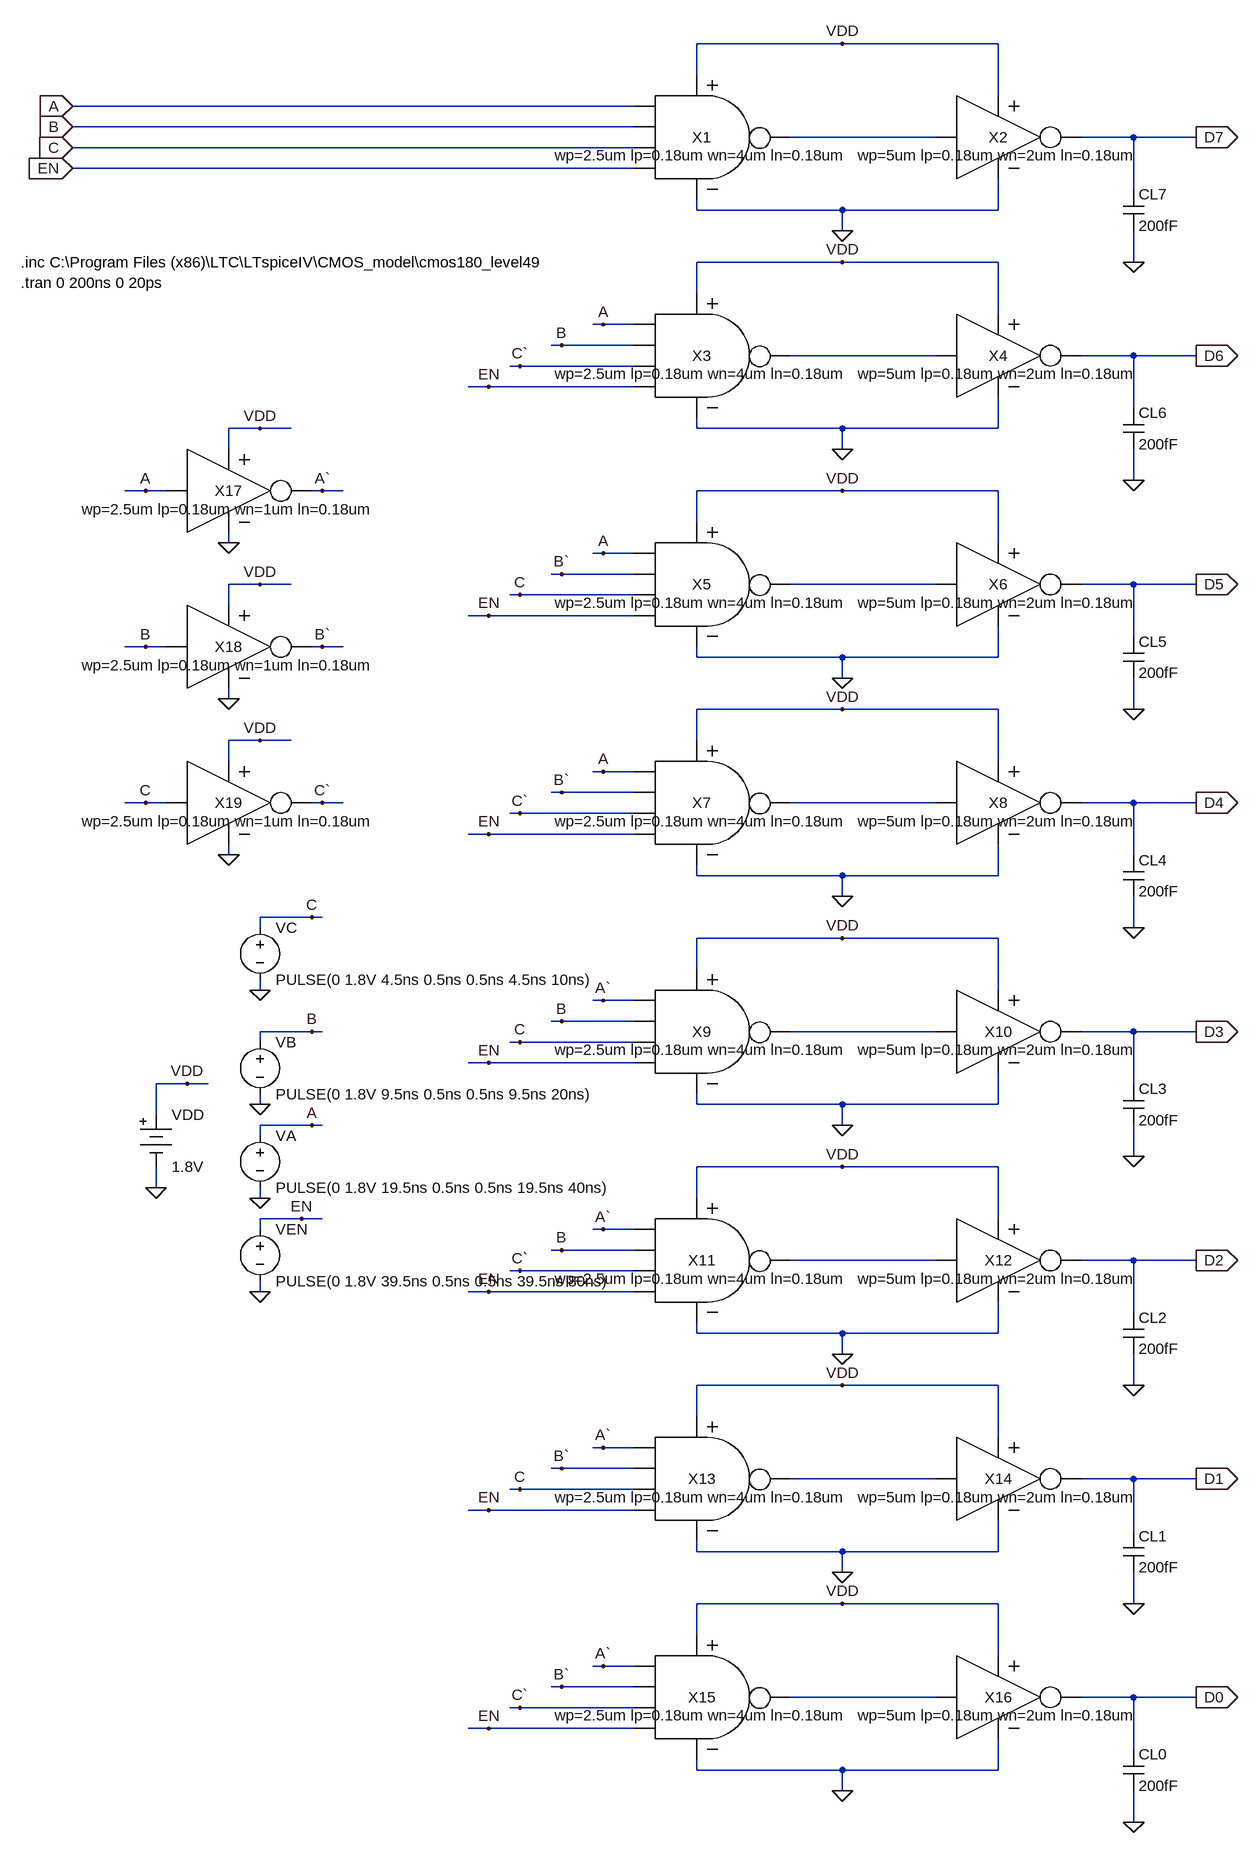
[diagram p0: schematic lab1-1.asc]
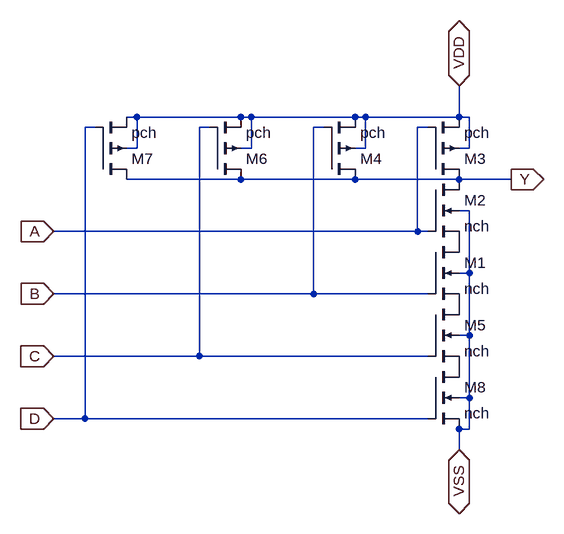
[diagram p1: sub-circuit nand4.asc]
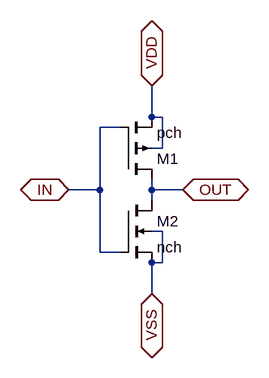
[diagram p2: sub-circuit inv.asc]
lab1-1.asc, the LTspice schematic file:
Version 4
SHEET 1 880 680
WIRE -2896 -4208 -3120 -4208
WIRE -2656 -4208 -2896 -4208
WIRE -3120 -4160 -3120 -4208
WIRE -2656 -4128 -2656 -4208
WIRE -3216 -4112 -4080 -4112
WIRE -3216 -4080 -4080 -4080
WIRE -2752 -4064 -2976 -4064
WIRE -2448 -4064 -2528 -4064
WIRE -2352 -4064 -2448 -4064
WIRE -3216 -4048 -4080 -4048
WIRE -3216 -4016 -4080 -4016
WIRE -2448 -3984 -2448 -4064
WIRE -3120 -3952 -3120 -3968
WIRE -2896 -3952 -3120 -3952
WIRE -2656 -3952 -2656 -4000
WIRE -2656 -3952 -2896 -3952
WIRE -2896 -3920 -2896 -3952
WIRE -2896 -3872 -3120 -3872
WIRE -2656 -3872 -2896 -3872
WIRE -2448 -3872 -2448 -3920
WIRE -3120 -3824 -3120 -3872
WIRE -2656 -3792 -2656 -3872
WIRE -3264 -3776 -3280 -3776
WIRE -3216 -3776 -3264 -3776
WIRE -3328 -3744 -3344 -3744
WIRE -3216 -3744 -3328 -3744
WIRE -2752 -3728 -2976 -3728
WIRE -2448 -3728 -2528 -3728
WIRE -2352 -3728 -2448 -3728
WIRE -3392 -3712 -3408 -3712
WIRE -3216 -3712 -3392 -3712
WIRE -3440 -3680 -3472 -3680
WIRE -3216 -3680 -3440 -3680
WIRE -2448 -3648 -2448 -3728
WIRE -3792 -3616 -3840 -3616
WIRE -3744 -3616 -3792 -3616
WIRE -3120 -3616 -3120 -3632
WIRE -2896 -3616 -3120 -3616
WIRE -2656 -3616 -2656 -3664
WIRE -2656 -3616 -2896 -3616
WIRE -3840 -3584 -3840 -3616
WIRE -2896 -3584 -2896 -3616
WIRE -2448 -3536 -2448 -3584
WIRE -3968 -3520 -4000 -3520
WIRE -3936 -3520 -3968 -3520
WIRE -3696 -3520 -3712 -3520
WIRE -3664 -3520 -3696 -3520
WIRE -2896 -3520 -3120 -3520
WIRE -2656 -3520 -2896 -3520
WIRE -3120 -3472 -3120 -3520
WIRE -3840 -3440 -3840 -3456
WIRE -2656 -3440 -2656 -3520
WIRE -3264 -3424 -3280 -3424
WIRE -3216 -3424 -3264 -3424
WIRE -3328 -3392 -3344 -3392
WIRE -3216 -3392 -3328 -3392
WIRE -3792 -3376 -3840 -3376
WIRE -3744 -3376 -3792 -3376
WIRE -2752 -3376 -2976 -3376
WIRE -2448 -3376 -2528 -3376
WIRE -2352 -3376 -2448 -3376
WIRE -3392 -3360 -3408 -3360
WIRE -3216 -3360 -3392 -3360
WIRE -3840 -3344 -3840 -3376
WIRE -3440 -3328 -3472 -3328
WIRE -3216 -3328 -3440 -3328
WIRE -2448 -3296 -2448 -3376
WIRE -3968 -3280 -4000 -3280
WIRE -3936 -3280 -3968 -3280
WIRE -3696 -3280 -3712 -3280
WIRE -3664 -3280 -3696 -3280
WIRE -3120 -3264 -3120 -3280
WIRE -2896 -3264 -3120 -3264
WIRE -2656 -3264 -2656 -3312
WIRE -2656 -3264 -2896 -3264
WIRE -2896 -3232 -2896 -3264
WIRE -3840 -3200 -3840 -3216
WIRE -2896 -3184 -3120 -3184
WIRE -2656 -3184 -2896 -3184
WIRE -2448 -3184 -2448 -3232
WIRE -3792 -3136 -3840 -3136
WIRE -3744 -3136 -3792 -3136
WIRE -3120 -3136 -3120 -3184
WIRE -3840 -3104 -3840 -3136
WIRE -2656 -3104 -2656 -3184
WIRE -3264 -3088 -3280 -3088
WIRE -3216 -3088 -3264 -3088
WIRE -3328 -3056 -3344 -3056
WIRE -3216 -3056 -3328 -3056
WIRE -3968 -3040 -4000 -3040
WIRE -3936 -3040 -3968 -3040
WIRE -3696 -3040 -3712 -3040
WIRE -3664 -3040 -3696 -3040
WIRE -2752 -3040 -2976 -3040
WIRE -2448 -3040 -2528 -3040
WIRE -2352 -3040 -2448 -3040
WIRE -3392 -3024 -3408 -3024
WIRE -3216 -3024 -3392 -3024
WIRE -3440 -2992 -3472 -2992
WIRE -3216 -2992 -3440 -2992
WIRE -3840 -2960 -3840 -2976
WIRE -2448 -2960 -2448 -3040
WIRE -3120 -2928 -3120 -2944
WIRE -2896 -2928 -3120 -2928
WIRE -2656 -2928 -2656 -2976
WIRE -2656 -2928 -2896 -2928
WIRE -2896 -2896 -2896 -2928
WIRE -3712 -2864 -3792 -2864
WIRE -3696 -2864 -3712 -2864
WIRE -3792 -2848 -3792 -2864
WIRE -2448 -2848 -2448 -2896
WIRE -2896 -2832 -3120 -2832
WIRE -2656 -2832 -2896 -2832
WIRE -3120 -2784 -3120 -2832
WIRE -3792 -2752 -3792 -2768
WIRE -2656 -2752 -2656 -2832
WIRE -3264 -2736 -3280 -2736
WIRE -3216 -2736 -3264 -2736
WIRE -3328 -2704 -3344 -2704
WIRE -3216 -2704 -3328 -2704
WIRE -3712 -2688 -3792 -2688
WIRE -3696 -2688 -3712 -2688
WIRE -2752 -2688 -2976 -2688
WIRE -2448 -2688 -2528 -2688
WIRE -2352 -2688 -2448 -2688
WIRE -3792 -2672 -3792 -2688
WIRE -3392 -2672 -3408 -2672
WIRE -3216 -2672 -3392 -2672
WIRE -3440 -2640 -3472 -2640
WIRE -3216 -2640 -3440 -2640
WIRE -3904 -2608 -3952 -2608
WIRE -3872 -2608 -3904 -2608
WIRE -2448 -2608 -2448 -2688
WIRE -3792 -2576 -3792 -2592
WIRE -3120 -2576 -3120 -2592
WIRE -2896 -2576 -3120 -2576
WIRE -2656 -2576 -2656 -2624
WIRE -2656 -2576 -2896 -2576
WIRE -3952 -2560 -3952 -2608
WIRE -3712 -2544 -3792 -2544
WIRE -3696 -2544 -3712 -2544
WIRE -2896 -2544 -2896 -2576
WIRE -3792 -2528 -3792 -2544
WIRE -2448 -2496 -2448 -2544
WIRE -2896 -2480 -3120 -2480
WIRE -2656 -2480 -2896 -2480
WIRE -3952 -2448 -3952 -2480
WIRE -3792 -2432 -3792 -2448
WIRE -3120 -2432 -3120 -2480
WIRE -3728 -2400 -3792 -2400
WIRE -3696 -2400 -3728 -2400
WIRE -2656 -2400 -2656 -2480
WIRE -3792 -2384 -3792 -2400
WIRE -3264 -2384 -3280 -2384
WIRE -3216 -2384 -3264 -2384
WIRE -3328 -2352 -3344 -2352
WIRE -3216 -2352 -3328 -2352
WIRE -2752 -2336 -2976 -2336
WIRE -2448 -2336 -2528 -2336
WIRE -2352 -2336 -2448 -2336
WIRE -3392 -2320 -3408 -2320
WIRE -3216 -2320 -3392 -2320
WIRE -3792 -2288 -3792 -2304
WIRE -3440 -2288 -3472 -2288
WIRE -3216 -2288 -3440 -2288
WIRE -2448 -2256 -2448 -2336
WIRE -3120 -2224 -3120 -2240
WIRE -2896 -2224 -3120 -2224
WIRE -2656 -2224 -2656 -2272
WIRE -2656 -2224 -2896 -2224
WIRE -2896 -2192 -2896 -2224
WIRE -2896 -2144 -3120 -2144
WIRE -2656 -2144 -2896 -2144
WIRE -2448 -2144 -2448 -2192
WIRE -3120 -2096 -3120 -2144
WIRE -2656 -2064 -2656 -2144
WIRE -3264 -2048 -3280 -2048
WIRE -3216 -2048 -3264 -2048
WIRE -3328 -2016 -3344 -2016
WIRE -3216 -2016 -3328 -2016
WIRE -2752 -2000 -2976 -2000
WIRE -2448 -2000 -2528 -2000
WIRE -2352 -2000 -2448 -2000
WIRE -3392 -1984 -3408 -1984
WIRE -3216 -1984 -3392 -1984
WIRE -3440 -1952 -3472 -1952
WIRE -3216 -1952 -3440 -1952
WIRE -2448 -1920 -2448 -2000
WIRE -3120 -1888 -3120 -1904
WIRE -2896 -1888 -3120 -1888
WIRE -2656 -1888 -2656 -1936
WIRE -2656 -1888 -2896 -1888
WIRE -2896 -1856 -2896 -1888
WIRE -2896 -1808 -3120 -1808
WIRE -2656 -1808 -2896 -1808
WIRE -2448 -1808 -2448 -1856
WIRE -3120 -1760 -3120 -1808
WIRE -2656 -1728 -2656 -1808
WIRE -3264 -1712 -3280 -1712
WIRE -3216 -1712 -3264 -1712
WIRE -3328 -1680 -3344 -1680
WIRE -3216 -1680 -3328 -1680
WIRE -2752 -1664 -2976 -1664
WIRE -2448 -1664 -2528 -1664
WIRE -2352 -1664 -2448 -1664
WIRE -3392 -1648 -3408 -1648
WIRE -3216 -1648 -3392 -1648
WIRE -3440 -1616 -3472 -1616
WIRE -3216 -1616 -3440 -1616
WIRE -2448 -1584 -2448 -1664
WIRE -3120 -1552 -3120 -1568
WIRE -2896 -1552 -3120 -1552
WIRE -2656 -1552 -2656 -1600
WIRE -2656 -1552 -2896 -1552
WIRE -2896 -1520 -2896 -1552
WIRE -2448 -1472 -2448 -1520
FLAG -3792 -2576 0
FLAG -3792 -2432 0
FLAG -3792 -2288 0
FLAG -3792 -2752 0
FLAG -3952 -2448 0
FLAG -3904 -2608 VDD
FLAG -3728 -2400 EN
FLAG -3712 -2864 C
FLAG -3712 -2688 B
FLAG -3712 -2544 A
FLAG -2896 -3920 0
FLAG -2448 -3872 0
FLAG -2352 -4064 D7
IOPIN -2352 -4064 Out
FLAG -2896 -3584 0
FLAG -2448 -3536 0
FLAG -2352 -3728 D6
IOPIN -2352 -3728 Out
FLAG -3440 -3680 EN
FLAG -3392 -3712 C`
FLAG -3328 -3744 B
FLAG -3264 -3776 A
FLAG -2896 -3232 0
FLAG -2448 -3184 0
FLAG -2352 -3376 D5
IOPIN -2352 -3376 Out
FLAG -3440 -3328 EN
FLAG -3392 -3360 C
FLAG -3328 -3392 B`
FLAG -3264 -3424 A
FLAG -2896 -2896 0
FLAG -2448 -2848 0
FLAG -2352 -3040 D4
IOPIN -2352 -3040 Out
FLAG -3440 -2992 EN
FLAG -3392 -3024 C`
FLAG -3328 -3056 B`
FLAG -3264 -3088 A
FLAG -2896 -2544 0
FLAG -2448 -2496 0
FLAG -2352 -2688 D3
IOPIN -2352 -2688 Out
FLAG -3440 -2640 EN
FLAG -3392 -2672 C
FLAG -3328 -2704 B
FLAG -3264 -2736 A`
FLAG -2896 -2192 0
FLAG -2448 -2144 0
FLAG -2352 -2336 D2
IOPIN -2352 -2336 Out
FLAG -3440 -2288 EN
FLAG -3392 -2320 C`
FLAG -3328 -2352 B
FLAG -3264 -2384 A`
FLAG -2896 -1856 0
FLAG -2448 -1808 0
FLAG -2352 -2000 D1
IOPIN -2352 -2000 Out
FLAG -3440 -1952 EN
FLAG -3392 -1984 C
FLAG -3328 -2016 B`
FLAG -3264 -2048 A`
FLAG -2896 -1520 0
FLAG -2448 -1472 0
FLAG -2352 -1664 D0
IOPIN -2352 -1664 Out
FLAG -3440 -1616 EN
FLAG -3392 -1648 C`
FLAG -3328 -1680 B`
FLAG -3264 -1712 A`
FLAG -3840 -3440 0
FLAG -3792 -3616 VDD
FLAG -4080 -4112 A
IOPIN -4080 -4112 In
FLAG -4080 -4080 B
IOPIN -4080 -4080 In
FLAG -4080 -4048 C
IOPIN -4080 -4048 In
FLAG -4080 -4016 EN
IOPIN -4080 -4016 In
FLAG -3840 -3200 0
FLAG -3792 -3376 VDD
FLAG -3840 -2960 0
FLAG -3792 -3136 VDD
FLAG -3968 -3280 B
FLAG -3968 -3040 C
FLAG -3968 -3520 A
FLAG -3696 -3520 A`
FLAG -3696 -3280 B`
FLAG -3696 -3040 C`
FLAG -2896 -2832 VDD
FLAG -2896 -3184 VDD
FLAG -2896 -3520 VDD
FLAG -2896 -3872 VDD
FLAG -2896 -2144 VDD
FLAG -2896 -1808 VDD
FLAG -2896 -2480 VDD
FLAG -2896 -4208 VDD
SYMBOL Misc\\battery -3952 -2576 R0
WINDOW 123 0 0 Left 2
WINDOW 39 0 0 Left 2
SYMATTR InstName VDD
SYMATTR Value 1.8V
SYMBOL voltage -3792 -2864 R0
WINDOW 123 0 0 Left 2
WINDOW 39 0 0 Left 2
SYMATTR InstName VC
SYMATTR Value PULSE(0 1.8V 4.5ns 0.5ns 0.5ns 4.5ns 10ns)
SYMBOL voltage -3792 -2688 R0
SYMATTR InstName VB
SYMATTR Value PULSE(0 1.8V 9.5ns 0.5ns 0.5ns 9.5ns 20ns)
SYMBOL voltage -3792 -2544 R0
WINDOW 123 0 0 Left 2
WINDOW 39 0 0 Left 2
SYMATTR InstName VA
SYMATTR Value PULSE(0 1.8V 19.5ns 0.5ns 0.5ns 19.5ns 40ns)
SYMBOL voltage -3792 -2400 R0
WINDOW 123 0 0 Left 2
WINDOW 39 0 0 Left 2
SYMATTR InstName VEN
SYMATTR Value PULSE(0 1.8V 39.5ns 0.5ns 0.5ns 39.5ns 80ns)
SYMBOL nand4 -3104 -4064 R0
WINDOW 39 -8 28 Center 2
SYMATTR SpiceLine wp=2.5um lp=0.18um wn=4um ln=0.18um
SYMATTR InstName X1
SYMBOL inv -2656 -4064 R0
WINDOW 39 0 28 Center 2
SYMATTR SpiceLine wp=5um lp=0.18um wn=2um ln=0.18um
SYMATTR InstName X2
SYMBOL cap -2464 -3984 R0
SYMATTR InstName CL7
SYMATTR Value 200fF
SYMBOL nand4 -3104 -3728 R0
WINDOW 39 -8 28 Center 2
SYMATTR SpiceLine wp=2.5um lp=0.18um wn=4um ln=0.18um
SYMATTR InstName X3
SYMBOL inv -2656 -3728 R0
WINDOW 39 0 28 Center 2
SYMATTR SpiceLine wp=5um lp=0.18um wn=2um ln=0.18um
SYMATTR InstName X4
SYMBOL cap -2464 -3648 R0
SYMATTR InstName CL6
SYMATTR Value 200fF
SYMBOL nand4 -3104 -3376 R0
WINDOW 39 -8 28 Center 2
SYMATTR SpiceLine wp=2.5um lp=0.18um wn=4um ln=0.18um
SYMATTR InstName X5
SYMBOL inv -2656 -3376 R0
WINDOW 39 0 28 Center 2
SYMATTR SpiceLine wp=5um lp=0.18um wn=2um ln=0.18um
SYMATTR InstName X6
SYMBOL cap -2464 -3296 R0
SYMATTR InstName CL5
SYMATTR Value 200fF
SYMBOL nand4 -3104 -3040 R0
WINDOW 39 -8 28 Center 2
SYMATTR SpiceLine wp=2.5um lp=0.18um wn=4um ln=0.18um
SYMATTR InstName X7
SYMBOL inv -2656 -3040 R0
WINDOW 39 0 28 Center 2
SYMATTR SpiceLine wp=5um lp=0.18um wn=2um ln=0.18um
SYMATTR InstName X8
SYMBOL cap -2464 -2960 R0
SYMATTR InstName CL4
SYMATTR Value 200fF
SYMBOL nand4 -3104 -2688 R0
WINDOW 39 -8 28 Center 2
SYMATTR SpiceLine wp=2.5um lp=0.18um wn=4um ln=0.18um
SYMATTR InstName X9
SYMBOL inv -2656 -2688 R0
WINDOW 39 0 28 Center 2
SYMATTR SpiceLine wp=5um lp=0.18um wn=2um ln=0.18um
SYMATTR InstName X10
SYMBOL cap -2464 -2608 R0
SYMATTR InstName CL3
SYMATTR Value 200fF
SYMBOL nand4 -3104 -2336 R0
WINDOW 39 -8 28 Center 2
SYMATTR SpiceLine wp=2.5um lp=0.18um wn=4um ln=0.18um
SYMATTR InstName X11
SYMBOL inv -2656 -2336 R0
WINDOW 39 0 28 Center 2
SYMATTR SpiceLine wp=5um lp=0.18um wn=2um ln=0.18um
SYMATTR InstName X12
SYMBOL cap -2464 -2256 R0
SYMATTR InstName CL2
SYMATTR Value 200fF
SYMBOL nand4 -3104 -2000 R0
WINDOW 39 -8 28 Center 2
SYMATTR SpiceLine wp=2.5um lp=0.18um wn=4um ln=0.18um
SYMATTR InstName X13
SYMBOL inv -2656 -2000 R0
WINDOW 39 0 28 Center 2
SYMATTR SpiceLine wp=5um lp=0.18um wn=2um ln=0.18um
SYMATTR InstName X14
SYMBOL cap -2464 -1920 R0
SYMATTR InstName CL1
SYMATTR Value 200fF
SYMBOL nand4 -3104 -1664 R0
WINDOW 39 -8 28 Center 2
SYMATTR SpiceLine wp=2.5um lp=0.18um wn=4um ln=0.18um
SYMATTR InstName X15
SYMBOL inv -2656 -1664 R0
WINDOW 39 0 28 Center 2
SYMATTR SpiceLine wp=5um lp=0.18um wn=2um ln=0.18um
SYMATTR InstName X16
SYMBOL cap -2464 -1584 R0
SYMATTR InstName CL0
SYMATTR Value 200fF
SYMBOL inv -3840 -3520 R0
WINDOW 39 0 28 Center 2
SYMATTR SpiceLine wp=2.5um lp=0.18um wn=1um ln=0.18um
SYMATTR InstName X17
SYMBOL inv -3840 -3280 R0
WINDOW 39 0 28 Center 2
SYMATTR SpiceLine wp=2.5um lp=0.18um wn=1um ln=0.18um
SYMATTR InstName X18
SYMBOL inv -3840 -3040 R0
WINDOW 39 0 28 Center 2
SYMATTR SpiceLine wp=2.5um lp=0.18um wn=1um ln=0.18um
SYMATTR InstName X19
TEXT -4160 -3872 Left 2 !.inc C:\\Program Files (x86)\\LTC\\LTspiceIV\\CMOS_model\\cmos180_level49
TEXT -4160 -3840 Left 2 !.tran 0 200ns 0 20ps

nand4.asc, the sub-circuit schematic file:
Version 4
SHEET 1 880 680
WIRE -256 -32 -272 -32
WIRE -96 -32 -256 -32
WIRE -80 -32 -96 -32
WIRE 80 -32 -80 -32
WIRE 96 -32 80 -32
WIRE 240 -32 240 -80
WIRE 240 -32 96 -32
WIRE 256 -32 240 -32
WIRE -320 -16 -336 -16
WIRE -144 -16 -160 -16
WIRE 32 -16 16 -16
WIRE 192 -16 176 -16
WIRE -256 16 -256 -32
WIRE -256 16 -272 16
WIRE -80 16 -80 -32
WIRE -80 16 -96 16
WIRE 96 16 96 -32
WIRE 96 16 80 16
WIRE 256 16 256 -32
WIRE 256 16 240 16
WIRE -96 64 -272 64
WIRE 80 64 -96 64
WIRE 240 64 80 64
WIRE 320 64 240 64
WIRE 256 112 240 112
WIRE 176 144 176 -16
WIRE 176 144 -384 144
WIRE 192 144 176 144
WIRE 256 208 256 112
WIRE 256 208 240 208
WIRE 16 240 16 -16
WIRE 16 240 -384 240
WIRE 192 240 16 240
WIRE 256 304 256 208
WIRE 256 304 240 304
WIRE -160 336 -160 -16
WIRE -160 336 -384 336
WIRE 192 336 -160 336
WIRE 256 400 256 304
WIRE 256 400 240 400
WIRE -336 432 -336 -16
WIRE -336 432 -384 432
WIRE 192 432 -336 432
WIRE 256 448 256 400
WIRE 256 448 240 448
WIRE 240 480 240 448
FLAG -384 144 A
IOPIN -384 144 In
FLAG -384 240 B
IOPIN -384 240 In
FLAG 320 64 Y
IOPIN 320 64 Out
FLAG -384 336 C
IOPIN -384 336 In
FLAG -384 432 D
IOPIN -384 432 In
FLAG 240 480 VSS
IOPIN 240 480 BiDir
FLAG 240 -80 VDD
IOPIN 240 -80 BiDir
SYMBOL nmos4 192 160 R0
SYMATTR InstName M1
SYMATTR Value nch
SYMATTR Value2 l=ln w=wn
SYMBOL nmos4 192 64 R0
SYMATTR InstName M2
SYMATTR Value nch
SYMATTR Value2 l=ln w=wn
SYMBOL pmos4 192 64 M180
SYMATTR InstName M3
SYMATTR Value pch
SYMATTR Value2 l=lp w=wp
SYMBOL pmos4 32 64 M180
SYMATTR InstName M4
SYMATTR Value pch
SYMATTR Value2 l=lp w=wp
SYMBOL nmos4 192 256 R0
SYMATTR InstName M5
SYMATTR Value nch
SYMATTR Value2 l=ln w=wn
SYMBOL pmos4 -144 64 M180
SYMATTR InstName M6
SYMATTR Value pch
SYMATTR Value2 l=lp w=wp
SYMBOL nmos4 192 352 R0
SYMATTR InstName M8
SYMATTR Value nch
SYMATTR Value2 l=ln w=wn
SYMBOL pmos4 -320 64 M180
SYMATTR InstName M7
SYMATTR Value pch
SYMATTR Value2 l=lp w=wp

inv.asc, the sub-circuit schematic file:
Version 4
SHEET 1 880 680
WIRE 240 32 240 -16
WIRE 256 32 240 32
WIRE 192 48 160 48
WIRE 256 80 256 32
WIRE 256 80 240 80
WIRE 160 144 160 48
WIRE 160 144 112 144
WIRE 240 144 240 128
WIRE 288 144 240 144
WIRE 240 160 240 144
WIRE 256 208 240 208
WIRE 160 240 160 144
WIRE 192 240 160 240
WIRE 256 256 256 208
WIRE 256 256 240 256
WIRE 240 304 240 256
FLAG 112 144 IN
IOPIN 112 144 BiDir
FLAG 288 144 OUT
IOPIN 288 144 BiDir
FLAG 240 -16 VDD
IOPIN 240 -16 BiDir
FLAG 240 304 VSS
IOPIN 240 304 BiDir
SYMBOL pmos4 192 128 M180
SYMATTR InstName M1
SYMATTR Value pch
SYMATTR Value2 l=lp w=wp
SYMBOL nmos4 192 160 R0
SYMATTR InstName M2
SYMATTR Value nch
SYMATTR Value2 l=ln w=wn

The netlist it stands for:
* lab1-1.asc
VDD VDD 0 1.8V
VC C 0 PULSE(0 1.8V 4.5ns 0.5ns 0.5ns 4.5ns 10ns)
VB B 0 PULSE(0 1.8V 9.5ns 0.5ns 0.5ns 9.5ns 20ns)
VA A 0 PULSE(0 1.8V 19.5ns 0.5ns 0.5ns 19.5ns 40ns)
VEN EN 0 PULSE(0 1.8V 39.5ns 0.5ns 0.5ns 39.5ns 80ns)
XX1 A EN N001 B C VDD 0 nand4 params: wp=2.5um lp=0.18um wn=4um ln=0.18um
XX2 N001 D7 VDD 0 inv params: wp=5um lp=0.18um wn=2um ln=0.18um
CL7 D7 0 200fF
XX3 A EN N002 B C` VDD 0 nand4 params: wp=2.5um lp=0.18um wn=4um ln=0.18um
XX4 N002 D6 VDD 0 inv params: wp=5um lp=0.18um wn=2um ln=0.18um
CL6 D6 0 200fF
XX5 A EN N003 B` C VDD 0 nand4 params: wp=2.5um lp=0.18um wn=4um ln=0.18um
XX6 N003 D5 VDD 0 inv params: wp=5um lp=0.18um wn=2um ln=0.18um
CL5 D5 0 200fF
XX7 A EN N004 B` C` VDD 0 nand4 params: wp=2.5um lp=0.18um wn=4um ln=0.18um
XX8 N004 D4 VDD 0 inv params: wp=5um lp=0.18um wn=2um ln=0.18um
CL4 D4 0 200fF
XX9 A` EN N005 B C VDD 0 nand4 params: wp=2.5um lp=0.18um wn=4um ln=0.18um
XX10 N005 D3 VDD 0 inv params: wp=5um lp=0.18um wn=2um ln=0.18um
CL3 D3 0 200fF
XX11 A` EN N006 B C` VDD 0 nand4 params: wp=2.5um lp=0.18um wn=4um ln=0.18um
XX12 N006 D2 VDD 0 inv params: wp=5um lp=0.18um wn=2um ln=0.18um
CL2 D2 0 200fF
XX13 A` EN N007 B` C VDD 0 nand4 params: wp=2.5um lp=0.18um wn=4um ln=0.18um
XX14 N007 D1 VDD 0 inv params: wp=5um lp=0.18um wn=2um ln=0.18um
CL1 D1 0 200fF
XX15 A` EN N008 B` C` VDD 0 nand4 params: wp=2.5um lp=0.18um wn=4um ln=0.18um
XX16 N008 D0 VDD 0 inv params: wp=5um lp=0.18um wn=2um ln=0.18um
CL0 D0 0 200fF
XX17 A A` VDD 0 inv params: wp=2.5um lp=0.18um wn=1um ln=0.18um
XX18 B B` VDD 0 inv params: wp=2.5um lp=0.18um wn=1um ln=0.18um
XX19 C C` VDD 0 inv params: wp=2.5um lp=0.18um wn=1um ln=0.18um

* block symbol definitions
.subckt nand4 A D Y B C VDD VSS
M1 P001 B P002 VSS nch l=ln w=wn
M2 Y A P001 VSS nch l=ln w=wn
M3 Y A VDD VDD pch l=lp w=wp
M4 Y B VDD VDD pch l=lp w=wp
M5 P002 C P003 VSS nch l=ln w=wn
M6 Y C VDD VDD pch l=lp w=wp
M8 P003 D VSS VSS nch l=ln w=wn
M7 Y D VDD VDD pch l=lp w=wp
.ends nand4

.subckt inv IN OUT VDD VSS
M1 OUT IN VDD VDD pch l=lp w=wp
M2 OUT IN VSS VSS nch l=ln w=wn
.ends inv

.model NMOS NMOS
.model PMOS PMOS
.lib standard.mos
.inc C:\Program Files (x86)\LTC\LTspiceIV\CMOS_model\cmos180_level49
.tran 0 200ns 0 20ps
.backanno
.end

* Results of the author's LTspice run, read from the files saved beside the schematic
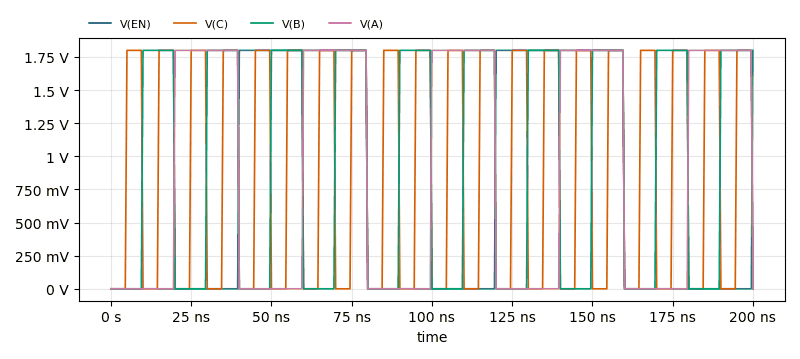
[diagram p3: Transient Analysis of lab1-1.asc, plotted from the saved traces]
* Transient Analysis, 1 run:
*   V(EN): min 0 V, max 1.8 V, average 722.2 mV, rms 1.137 V, last 1.8 V
*   V(C): min 0 V, max 1.8 V, average 900 mV, rms 1.251 V, last 0 V
*   V(B): min 0 V, max 1.8 V, average 900 mV, rms 1.262 V, last 0 V
*   V(A): min 0 V, max 1.8 V, average 900 mV, rms 1.267 V, last 0 V